# Altium schematic sheet BATTERY.SchDoc
size A4
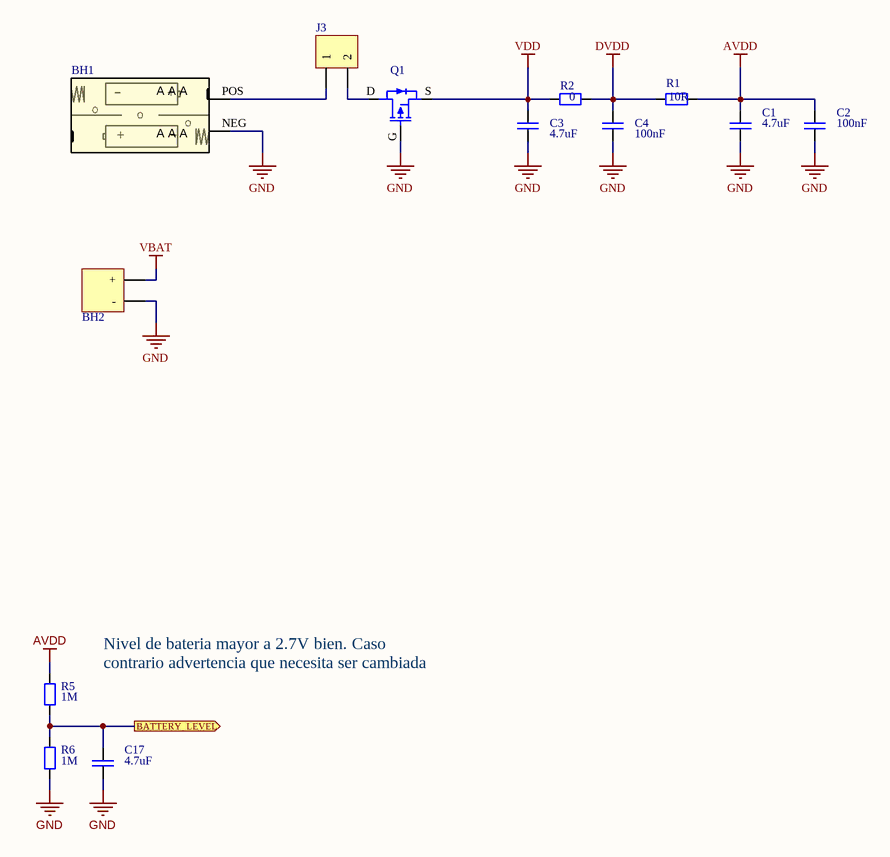
[diagram p0: BATTERY.SchDoc]

## Parts
BH1  2468  [BATTERY_HOLDER_2XAAA]  (value not drawn)
BH2  Battery Holder CR2032  [BS-08-B2AA016]  (value not drawn)
C1  4.7uF  [CAP_SM0805_YAGEOCC2_N]
C2  100nF  [CAP_SM0805_YAGEOCC2_N]
C3  4.7uF  [CAP_SM0805_YAGEOCC2_N]
C4  100nF  [CAP_SM0805_YAGEOCC2_N]
C17  4.7uF  [CAP_SM0805_YAGEOCC2_N]
J3  Usar Equivalente  [HEADER PIN 1X2]  (value not drawn)
Q1  DMG3401LSN-7  [DMG3401LSN-7]  (value not drawn)
R1  10R  [RES_SM0805_YAGEORC_N]
R2  0  [RES_SM0805_YAGEORC_N]
R5  1M  [RES_SM0805_YAGEORC_N]
R6  1M  [RES_SM0805_YAGEORC_N]

## Ports
BATTERY_LEVEL (out)

## Nets
AVDD: C1.1 C2.1 R1.2 R5.2
DVDD: C4.1 R1.1 R2.2
GND: BH1.NEG BH2.NEG(-) C1.2 C2.2 C3.2 C4.2 C17.2 Q1.G R6.1
VBAT: BH2.POS(+)
VDD: C3.1 Q1.S R2.1
BATTERY_LEVEL: C17.1 R5.1 R6.2 ; port BATTERY_LEVEL
NetBH1_POS: BH1.POS J3.1
NetJ3_2: J3.2 Q1.D

## Notes on the sheet
- Nivel de bateria mayor a 2.7V bien. Caso contrario advertencia que necesita ser cambiada
- Title:
- Size: A4
- Date:
- FMC-320U MODEL A
- Sheet:
- Time:
- Of:
- Version:
- Revision:
- Release:
- 1
- 0
- FLOWMEET SRL
- File
- (in symbol 2468) A A A; +; -

## Library data of the parts
BH1 = 2468: 2 x AAA through hole economic type; Manufacturer: Keystone Electronics; ComponentLink1Description: datasheet; ComponentLink1URL: https://www.keyelco.com/userAssets/file/M65p28.pdf; Manufacturer Part Number: 2468; Category: Battery holder
BH2 = BS-08-B2AA016: Battery base -25℃~+85℃ CR2032 SMD Battery Connectors ROHS /; Manufacturer: Myoung; Manufacturer part number: BS-08-B2AA016; Category: Battery holder; Datasheet: https://datasheet.lcsc.com/lcsc/2012181809_MYOUNG-BS-08-B2AA016_C964792.pdf
C1 C3 C17 = CC0805KRX5R6BB475: CAP 4.7uF SM0805 X5R 10V YAGEO CC2; Tolerance (%): 10; Category: Capacitor; Manufacturer: Yageo; Manufacturer Part Number: CC0805KRX5R6BB475; Package: 0805; Value: 4.7uF; Supplier Part Number 1: 718671; Supplier 1: Farnell; ComponentLink1URL: http://www.yageo.com; ComponentLink1Description: Manufacturer Website; Voltage Rating (Volts): 10; Supplier 2: Digi-Key; Supplier Part Number 2: 311-1374-1-ND; Datasheet: https://datasheet.lcsc.com/lcsc/2304140030_YAGEO-CC0805KRX5R6BB475_C605218.pdf
C2 C4 = CC0805KRX7R8BB104: CAP 100nF SM0805 X7R 25V YAGEO CC2; Tolerance (%): 10; Voltage Rating (Volts): 25; Category: Capacitor; Manufacturer: Yageo; Manufacturer Part Number: CC0805KRX7R8BB104; Package: 0805; Value: 100nF; Supplier Part Number 1: 644249; Supplier 1: Farnell; ComponentLink1URL: http://www.yageo.com; ComponentLink1Description: Manufacturer Website; Supplier 2: Digi-Key; Supplier Part Number 2: 311-1141-1-ND
J3 = 54101-T0602LF: 1 x 2 - true hole  2.54mm - Pb free; Manufacturer: Amphenol ICC; Equivalente: B-2100S02P-A110; Manufacturer Part Number: 54101-T0602LF; Category: Header pin; Datasheet: https://datasheet.lcsc.com/lcsc/2202082130_Amphenol-ICC-54101-T06-00_C213463.pdf
Q1 = DMG3401LSN-7: P-CHANNEL ENHANCEMENT MODE MOSFET / RDS(ON) = 85mΩ @ VGS = -2.5V -> ID -2.7A / V(BR)DDS 30V; Manufacturer: Diodes Incorporated; Category: Transistor mosfet; Manufacturer Part Number: DMG3401LSN-7; Datasheet: https://www.digikey.com/es/products/detail/diodes-incorporated/DMG3401LSN-7/3720138?s=N4IgTCBcDaICIFkDiBmALABgIwBkDKAcgLQDsIAugL5A
R1 = RC0805FR-0710RL: RES 10R SM0805 YAGEO RC_L; Power (Watts): 0.125; Resistance (Ohms): 10; Tolerance (%): 1; Category: Resistor; Manufacturer: Yageo; Manufacturer Part Number: RC0805FR-0710RL; Package: 0805; Value: 10R; Supplier Part Number 1: 9237240; Supplier 1: Farnell; ComponentLink1Description: Manufacturer Website; ComponentLink1URL: http://www.yageo.com; Supplier 2: Digi-Key; Supplier Part Number 2: 311-10.0CRCT-ND
R2 = RC0805JR-070RL: RES 0 OHMS SM0805 YAGEO RC_L; Manufacturer Part Number: RC0603FR-070RL; Power (Watts): 0.1; Tolerance (%): 1; Category: Resistor; Manufacturer: Yageo; Package: 0805; Resistance (Ohms): 0; Value: 0; ComponentLink1URL: http://www.yageo.com; ComponentLink1Description: Manufacturer Website; Supplier: LCSC
R5 R6 = RC0805FR-071ML: RES 1M SM0805 YAGEO RC_L; Power (Watts): 0.125; Resistance (Ohms): 1000000; Tolerance (%): 1; Category: Resistor; Manufacturer: Yageo; Manufacturer Part Number: RC0805FR-071ML; Package: 0805; Value: 1M; Supplier Part Number 1: 9237992; Supplier 1: Farnell; ComponentLink1URL: http://www.yageo.com; ComponentLink1Description: Manufacturer Website; Supplier 2: Digi-Key; Supplier Part Number 2: 311-1.00MCRCT-ND